# Altium project MotionBoard.PrjPcb (part 1 of 3)
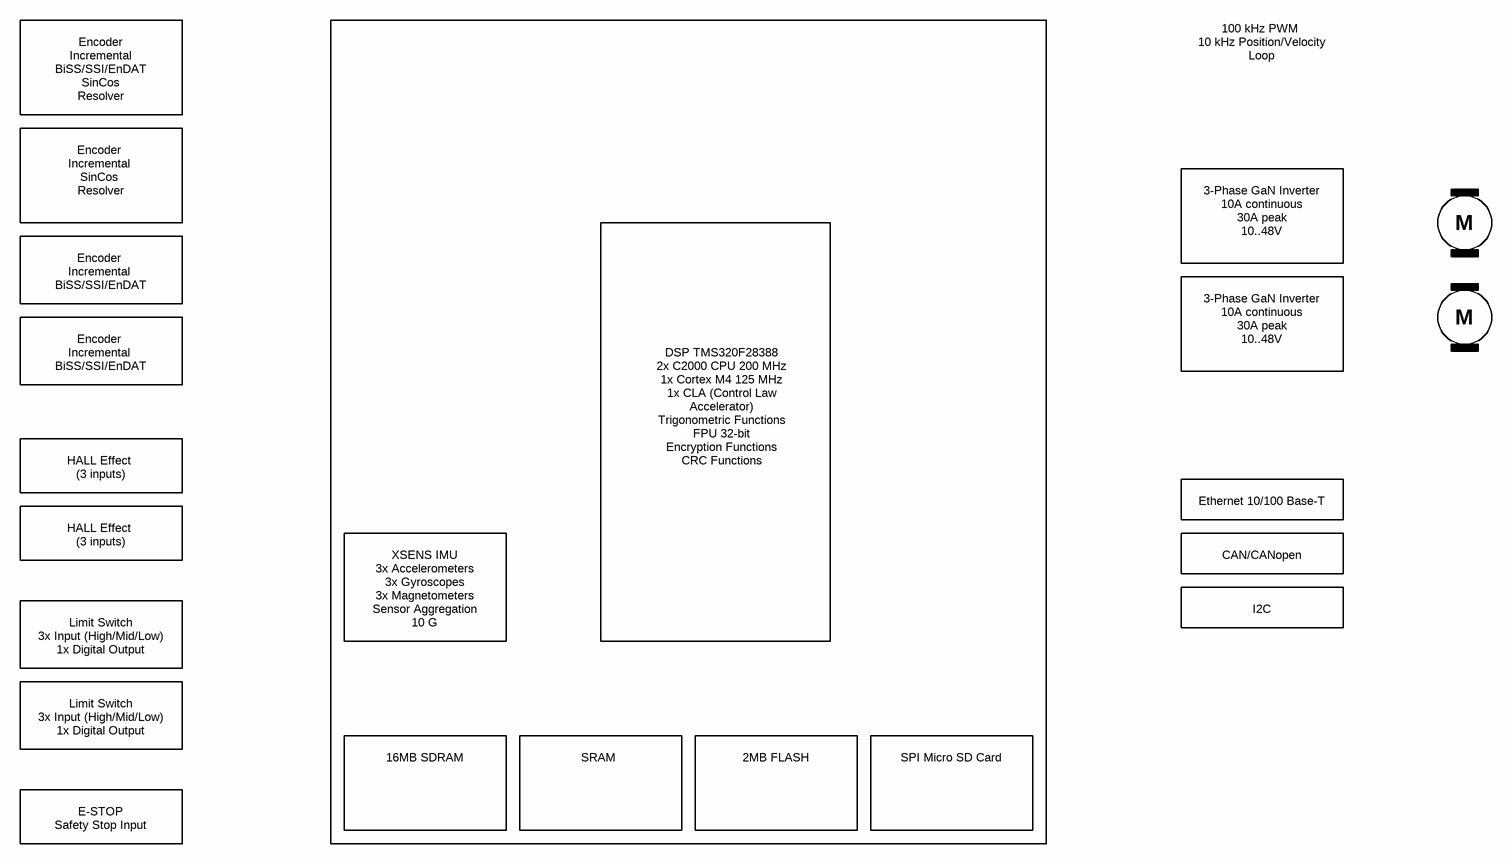
[diagram p0: overview.SchDoc]
Author: Prof. Yves Chevallier; NoProject: 377481; ProjectTitle: MotionBoard Columbi; SVN: GIT; Version: 0.1.0
17 sheets, 708 parts. Net scope: strictly hierarchical (ports join the sheet entries above them; power ports are local).
Board file: MotionBoard.PcbDoc
Sheets:
  overview.SchDoc
  main.SchDoc
    U_INVERTER-A = inverter.SchDoc
    U_ENC-A = digital-encoder.SchDoc
    CAN Transciever = can.SchDoc
    U_INVERTER-B = inverter.SchDoc
    DSP = dsp.SchDoc
      ADC/DAC = adc.SchDoc
      U_dsp-supply = dsp-supply.SchDoc
    Ethernet PHY = ethernet.SchDoc
    Designator = psu.SchDoc
    SDRAM/SRAM/FLASH = ext-memory.SchDoc
    USB HOST/DEVICE = usb.SchDoc
    Resolver Pseudo Sine Excitation = resolver-excitation.SchDoc
    U_ENC-C = analog-encoder.SchDoc
    Interial Management Unit = imu.SchDoc
    U_ENC-A = digital-encoder.SchDoc
    SDCARD = sdcard.SchDoc
    U_ENC-D = analog-encoder.SchDoc
    U_mechanical = mechanical.SchDoc

## Sheet overview.SchDoc: Overview
size A3; SheetNumber: 1; SheetTotal: 16

### Notes on the sheet
- Encoder
  Incremental
  BiSS/SSI/EnDAT
  SinCos
  Resolver
- 100 kHz PWM
  10 kHz Position/Velocity Loop
- Encoder
  Incremental
  SinCos
  Resolver
- 3-Phase GaN Inverter
  10A continuous
  30A peak
  10..48V
- M
- Encoder
  Incremental
  BiSS/SSI/EnDAT
- HALL Effect
  (3 inputs)
- DSP TMS320F28388
  2x C2000 CPU 200 MHz
  1x Cortex M4 125 MHz
  1x CLA (Control Law Accelerator)
  Trigonometric Functions
  FPU 32-bit
  Encryption Functions
  CRC Functions
- Ethernet 10/100 Base-T
- CAN/CANopen
- I2C
- Limit Switch
  3x Input (High/Mid/Low)
  1x Digital Output
- XSENS IMU
  3x Accelerometers
  3x Gyroscopes
  3x Magnetometers
  Sensor Aggregation
  10 G
- 16MB SDRAM
- SRAM
- 2MB FLASH
- SPI Micro SD Card
- E-STOP
  Safety Stop Input
- HES-SO / HEIG-VD / TIN / IAI
  Route de Cheseaux, 1
  CH-1401 Yverdon-les-Bains
  T +41 24 557 73 77    F +41 24 557 63 20
  http://iai.heig-vd.ch
  iai@heig-vd.ch
- Title
- Size
- Date
- A4
- Project
- Sheet
- of
- No.
- Author
- SVN/Git
- Version
- File

## Sheet main.SchDoc: Main Schema Block
size A3; SheetNumber: 2; SheetTotal: 17
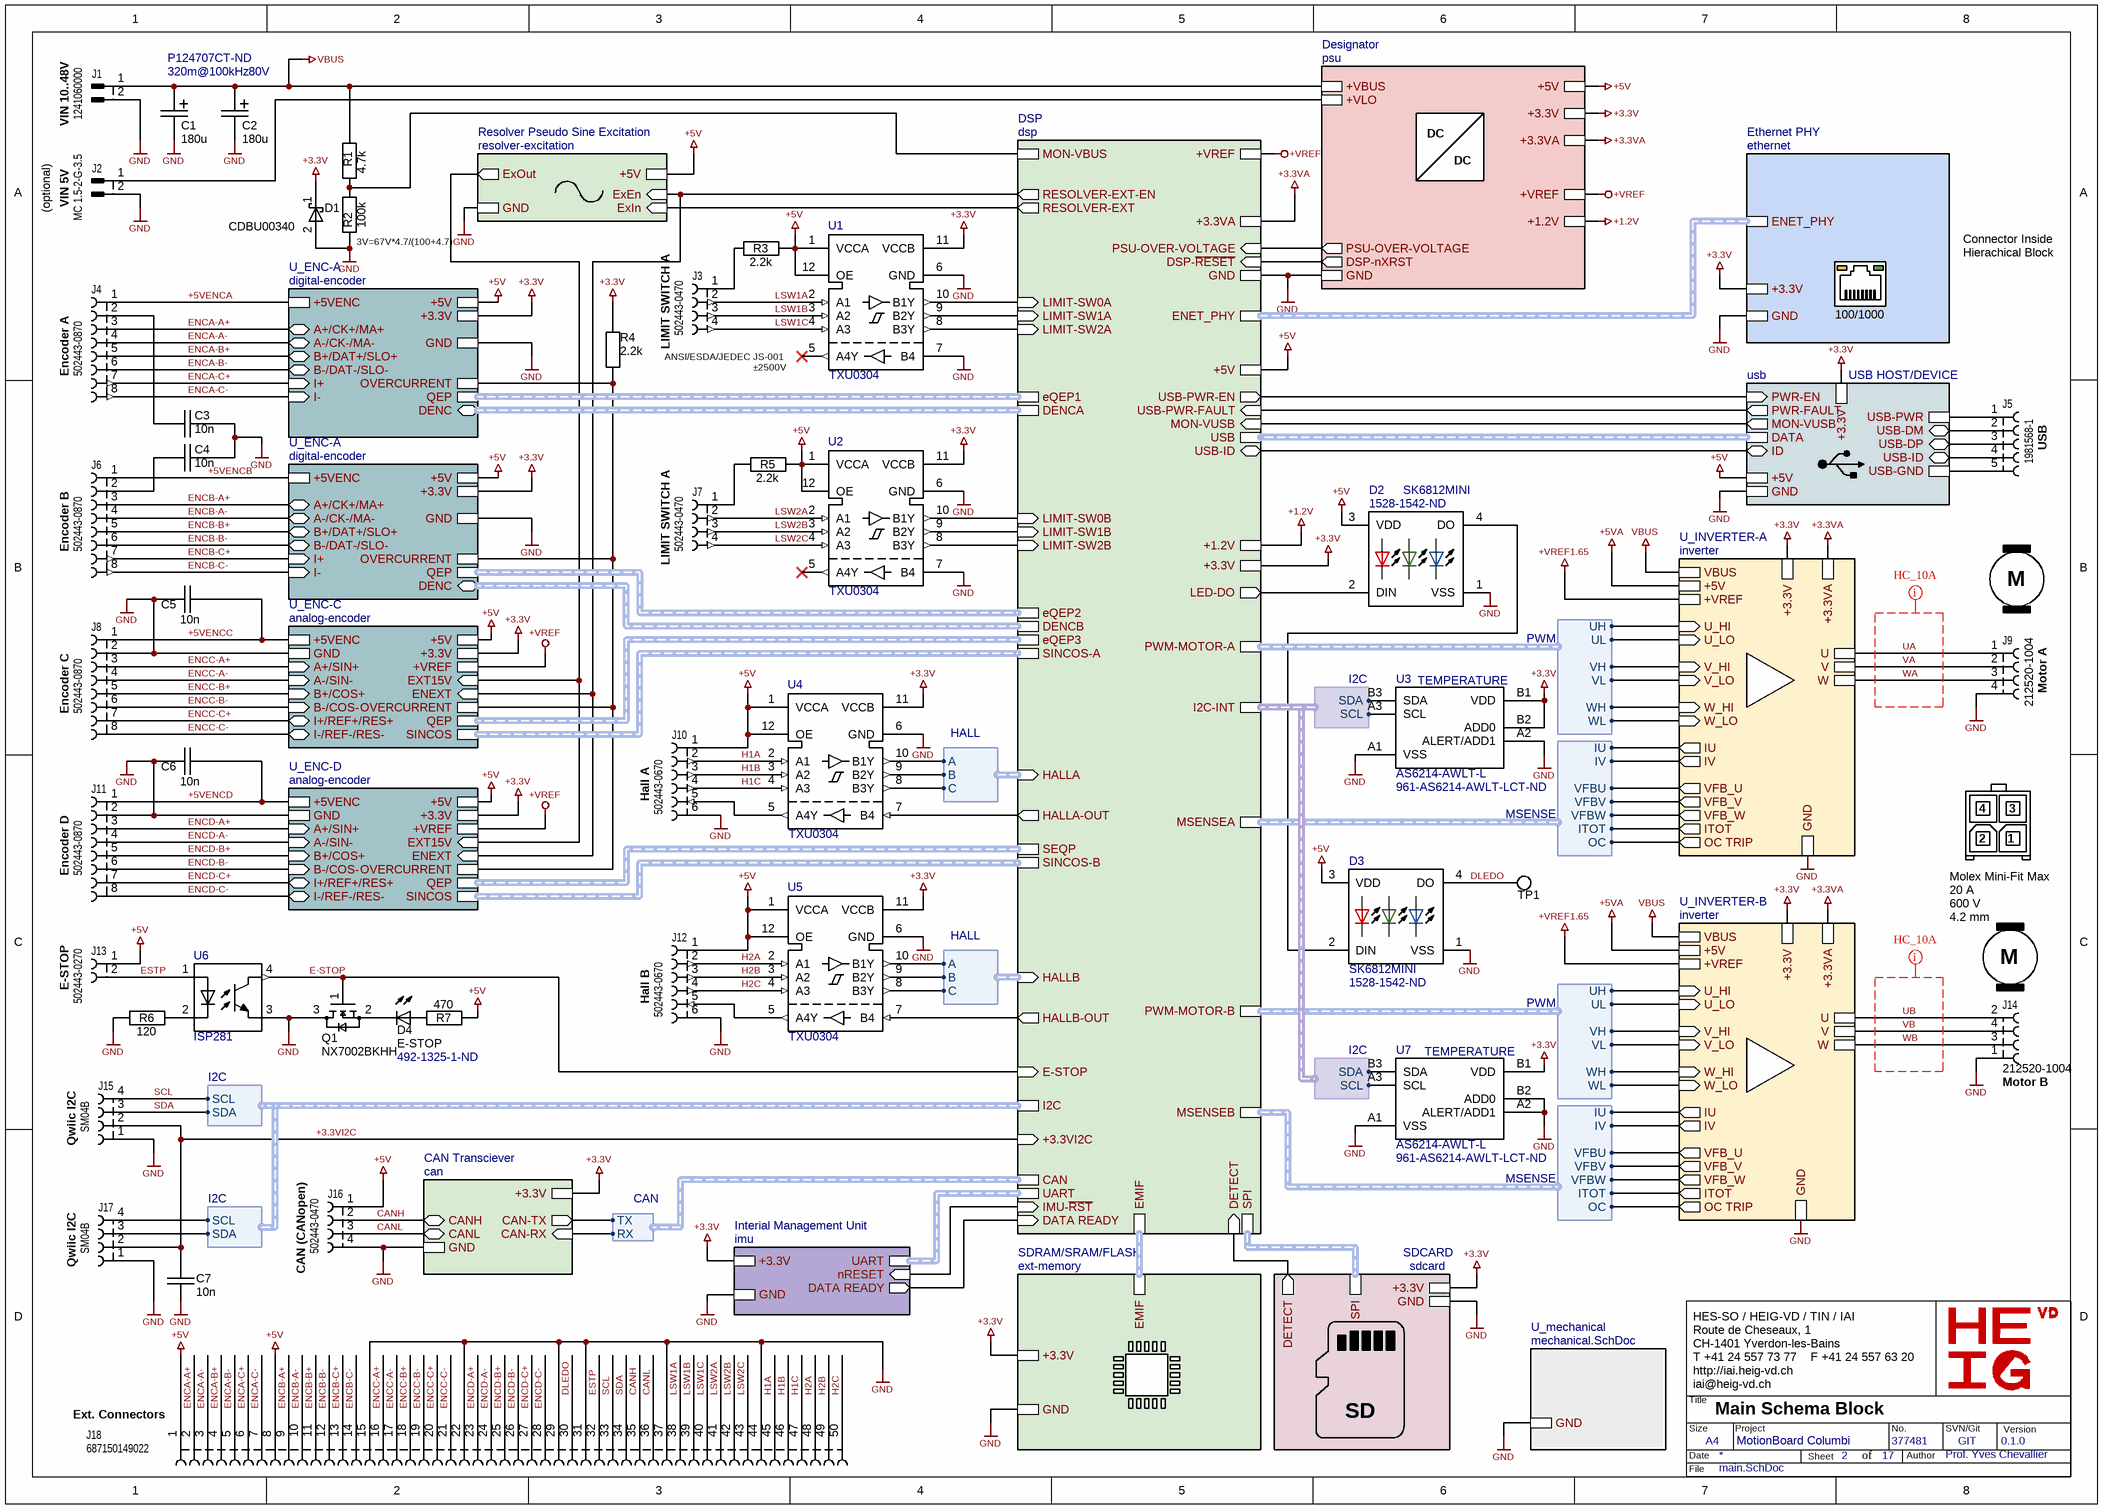
[diagram p1: main.SchDoc]

### Parts
(Parts that share a designator on the sheet are numbered #1, #2 ... from top to bottom, then left to right.)
C1  180u  Voltage: 80V  ESR: 320m@100kHz  Supplier Part Number 1: P124707CT-ND  [CAP_EEEFK1K151AV]
C2  180u  [CAP_EEEFK1K151AV]
C3  10n  [SM/C0402]
C4  10n  [SM/C0402]
C5  10n  [SM/C0402]
C6  10n  [SM/C0402]
C7  10n  [SM/C0402]
D1  CDBU00340  [SM/D0603/SOD523F]
D2  SK6812MINI  Supplier Part Number 1: 1528-1542-ND  [LED_SK6812]
D3  SK6812MINI  Supplier Part Number 1: 1528-1542-ND  [LED_SK6812]
D4  E-STOP  Supplier Part Number 1: 492-1325-1-ND  [SM/LED0603]
J1  1241060000  Function: VIN 10..48V  [CONN 2POS WEIDMULLER 5.08mm]
J2  MC 1.5-2-G-3.5  Function: VIN 5V  [CONN2/PHOENIX/MC 1.5-2-G-3.5]
J3  502443-0470  Function: LIMIT SWITCH A  [MOLEX/5024430470/CLIK-MATE/2mm]
J4  502443-0870  Function: Encoder A  [MOLEX/5024430870/CLIK-MATE/2mm]
J5#1  1981568-1  Function: USB  [TE/1981568-1/USB]
J6  502443-0870  Function: Encoder B  [MOLEX/5024430870/CLIK-MATE/2mm]
J7  502443-0470  Function: LIMIT SWITCH A  [MOLEX/5024430470/CLIK-MATE/2mm]
J8  502443-0870  Function: Encoder C  [MOLEX/5024430870/CLIK-MATE/2mm]
J9  212520-1004  Function: Motor A  [MOLEX/2125201004]
J10  502443-0670  Function: Hall A  [MOLEX/5024430670/CLIK-MATE/2mm]
J11  502443-0870  Function: Encoder D  [MOLEX/5024430870/CLIK-MATE/2mm]
J12  502443-0670  Function: Hall B  [MOLEX/5024430670/CLIK-MATE/2mm]
J13  502443-0270  Function: E-STOP  [MOLEX/5024430270/CLIK-MATE/2mm]
J14  212520-1004  Function: Motor B  [MOLEX/2125201004]
J15  SM04B  Function: Qwiic I2C  [QWIIC-SM04B-SRSS-TB]
J16  502443-0470  Function: CAN (CANopen)  [MOLEX/5024430470/CLIK-MATE/2mm]
J17  SM04B  Function: Qwiic I2C  [QWIIC-SM04B-SRSS-TB]
J18  687150149022  Function: Ext. Connectors  [687150149022]
Q1  NX7002BKHH  [SOT8001/DFN0606-3]
R1  4.7k  [SM/R0402]
R2  100k  [SM/R0805]
R3  2.2k  [SM/R0402]
R4  2.2k  [SM/R0402]
R5  2.2k  [SM/R0402]
R6  120  [SM/R0402]
R7  470  [SM/R0603]
TP1  RCUCTE  [TP/RCUCT]  (value not drawn)
U1  TXU0304  [QFN40P170X200X55-12N]
U2  TXU0304  [QFN40P170X200X55-12N]
U3  AS6214-AWLT-L  Supplier Part Number 1: 961-AS6214-AWLT-LCT-ND  [AS6214-AWLT-L_AMS]
U4  TXU0304  [QFN40P170X200X55-12N]
U5  TXU0304  [QFN40P170X200X55-12N]
U6  ISP281  [SOIC-4]
U7#1  AS6214-AWLT-L  Supplier Part Number 1: 961-AS6214-AWLT-LCT-ND  [AS6214-AWLT-L_AMS]

### Sub-sheets
CAN Transciever = can: CANL (bidir), CAN-RX (in), CANH (bidir), GND, CAN-TX (out), +3.3V
Designator = psu: DSP-nXRST (out), +3.3VA, +1.2V, +VBUS, +VLO, GND, +3.3V, +5V, +VREF, PSU-OVER-VOLTAGE (out)
DSP = dsp: SINCOS-B (harness SINCOS), MSENSEB (harness MSENSE), MSENSEA (harness MSENSE), SINCOS-A (harness SINCOS), I2C (harness I2C), EMIF (harness EMIF), PWM-MOTOR-A (harness PWM), CAN (harness CAN), ENET_PHY (harness ETHERNET), PWM-MOTOR-B (harness PWM), +3.3VI2C (in), USB-PWR-EN (out), USB-ID (bidir), USB-PWR-FAULT (in), USB (harness USB), HALLA (in, harness HALL), HALLB (in, harness HALL), LIMIT-SW0A (in), LIMIT-SW1A (in), LIMIT-SW2A (in), LIMIT-SW0B (in), LIMIT-SW1B (in), LIMIT-SW2B (in), eQEP3 (harness EQEP), SPI (harness SPI), eQEP2 (harness EQEP), E-STOP (in), eQEP1 (harness EQEP), DATA READY (in), +3.3V, +3.3VA, GND, +1.2V, +5V, HALLA-OUT (out), HALLB-OUT (out), I2C-INT (harness I2C), LED-DO (out), UART (harness UART), RESOLVER-EXT-EN (out), RESOLVER-EXT (out), IMU-~{RST} (in), DSP-~{RESET} (in), PSU-OVER-VOLTAGE (in), DENCA (harness DENC), SEQP (harness EQEP), DETECT (in), MON-VBUS, MON-VUSB (in), DENCB (harness DENC), +VREF
Ethernet PHY = ethernet: GND, ENET_PHY (harness ETHERNET), +3.3V
Interial Management Unit = imu: DATA READY (out), nRESET (in), UART (harness UART), GND, +3.3V
Resolver Pseudo Sine Excitation = resolver-excitation: ExEn (in), +5V, ExOut (out), GND, ExIn (in)
SDCARD = sdcard: +3.3V, SPI (harness SPI), GND, DETECT (out)
SDRAM/SRAM/FLASH = ext-memory: +3.3V, EMIF (harness EMIF), GND
U_ENC-A = digital-encoder: I+ (in), +5VENC, +3.3V, +5V, I- (in), B+/DAT+/SLO+ (bidir), A-/CK-/MA- (bidir), A+/CK+/MA+ (bidir), B-/DAT-/SLO- (bidir), DENC (bidir, harness DENC), QEP (harness EQEP), GND, OVERCURRENT
U_ENC-A = digital-encoder: I+ (in), +5VENC, +3.3V, +5V, I- (in), B+/DAT+/SLO+ (bidir), A-/CK-/MA- (bidir), A+/CK+/MA+ (bidir), B-/DAT-/SLO- (bidir), DENC (bidir, harness DENC), QEP (harness EQEP), GND, OVERCURRENT
U_ENC-C = analog-encoder: SINCOS (harness SINCOS), +5VENC, EXT15V (in), OVERCURRENT, +3.3V, +5V, I+/REF+/RES+ (bidir), I-/REF-/RES- (bidir), B-/COS- (in), B+/COS+ (in), A+/SIN+ (in), A-/SIN- (in), ENEXT (in), +VREF, GND, QEP (harness EQEP)
U_ENC-D = analog-encoder: SINCOS (harness SINCOS), +5VENC, EXT15V (in), OVERCURRENT, +3.3V, +5V, I+/REF+/RES+ (bidir), I-/REF-/RES- (bidir), B-/COS- (in), B+/COS+ (in), A+/SIN+ (in), A-/SIN- (in), ENEXT (in), +VREF, GND, QEP (harness EQEP)
U_INVERTER-A = inverter: U_LO (in), V_HI (in), U, VBUS, V, IU (out), W, V_LO (in), IV (out), U_HI (in), W_HI (in), W_LO (in), OC TRIP (out), VFB_W (out), ITOT (out), VFB_V (out), VFB_U (out), GND, +3.3V, +5V, +VREF, +3.3VA
U_INVERTER-B = inverter: U_LO (in), V_HI (in), U, VBUS, V, IU (out), W, V_LO (in), IV (out), U_HI (in), W_HI (in), W_LO (in), OC TRIP (out), VFB_W (out), ITOT (out), VFB_V (out), +VREF, VFB_U (out), +5V, GND, +3.3V, +3.3VA
U_mechanical = mechanical.SchDoc: GND
USB HOST/DEVICE = usb: GND, +5V, USB-DP (bidir), USB-DM (bidir), USB-PWR, USB-GND, USB-ID (bidir), PWR-EN (in), MON-VUSB (out), ID (bidir), DATA (harness USB), PWR-FAULT (out), +3.3V

### Harnesses
I2C: SCL, SDA
CAN: RX, TX
PWM: UH, UL, VH, VL, WH, WL
MSENSE: IU, IV, VFBU, VFBV, ITOT, OC, VFBW
HALL: A, B, C

### Nets
+1.2V: sheet DSP/+1.2V, sheet Designator/+1.2V
+3.3V: D1.1(K) R4.2 U1.11(VCCB) U2.11(VCCB) U3.B1(VDD) U3.B2(ADD0) U4.11(VCCB) U5.11(VCCB) U7#1.B1(VDD) ; sheet U_INVERTER-A/+3.3V, sheet U_ENC-A/+3.3V, sheet CAN Transciever/+3.3V, sheet U_INVERTER-B/+3.3V, sheet DSP/+3.3V, sheet Ethernet PHY/+3.3V, sheet Designator/+3.3V, sheet SDRAM/SRAM/FLASH/+3.3V, sheet USB HOST/DEVICE/+3.3V, sheet U_ENC-C/+3.3V, sheet Interial Management Unit/+3.3V, sheet U_ENC-A/+3.3V, sheet SDCARD/+3.3V, sheet U_ENC-D/+3.3V
+3.3VA: sheet U_INVERTER-A/+3.3VA, sheet U_INVERTER-B/+3.3VA, sheet DSP/+3.3VA, sheet Designator/+3.3VA
+5V: D2.3(VDD) D3.3(VDD) J10.1 J12.1 J13.1 J16.1 J18.1 J18.8 R3.2 R5.2 R7.2 U1.1(VCCA) U1.12(OE) U2.1(VCCA) U2.12(OE) U4.1(VCCA) U4.12(OE) U5.1(VCCA) U5.12(OE) ; sheet U_ENC-A/+5V, sheet DSP/+5V, sheet Designator/+5V, sheet USB HOST/DEVICE/+5V, sheet Resolver Pseudo Sine Excitation/+5V, sheet U_ENC-C/+5V, sheet U_ENC-A/+5V, sheet U_ENC-D/+5V
+5VA: sheet U_INVERTER-A/+5V, sheet U_INVERTER-B/+5V
+VREF: sheet DSP/+VREF, sheet Designator/+VREF, sheet U_ENC-C/+VREF, sheet U_ENC-D/+VREF
+VREF1.65: sheet U_INVERTER-A/+VREF, sheet U_INVERTER-B/+VREF
GND: C1.2(-) C2.2(-) C3.1 C4.1 C5.2 C6.2 C7.2 D1.2(A) D2.1(VSS) D3.1(VSS) J1.2 J2.2 J8.2 J9.4 J10.6 J11.2 J12.6 J14.1 J15.1 J16.4 J17.1 J18.15 J18.22 J18.29 J18.31 J18.37 J18.44 Q1.3(VCC) R2.2 R6.1 U1.6(GND) U1.7(B4) U2.6(GND) U2.7(B4) U3.A1(VSS) U3.A2(ALERT/ADD1) U4.6(GND) U5.6(GND) U6.3(E) U7#1.A1(VSS) U7#1.A2(ALERT/ADD1) U7#1.B2(ADD0) ; sheet U_INVERTER-A/GND, sheet U_ENC-A/GND, sheet CAN Transciever/GND, sheet U_INVERTER-B/GND, sheet DSP/GND, sheet Ethernet PHY/GND, sheet Designator/GND, sheet SDRAM/SRAM/FLASH/GND, sheet USB HOST/DEVICE/GND, sheet Resolver Pseudo Sine Excitation/GND, sheet U_ENC-C/GND, sheet Interial Management Unit/GND, sheet U_ENC-A/GND, sheet SDCARD/GND, sheet U_ENC-D/GND, sheet U_mechanical/GND
VBUS: C1.1(+) C2.1(+) J1.1 R1.1 ; sheet U_INVERTER-A/VBUS, sheet U_INVERTER-B/VBUS, sheet Designator/+VBUS
+3.3VI2C: C7.1 J15.2 J17.2 ; sheet DSP/+3.3VI2C
+5VENCA: J4.1 ; sheet U_ENC-A/+5VENC
+5VENCB: J6.1 ; sheet U_ENC-A/+5VENC
+5VENCC: C5.1 J8.1 ; sheet U_ENC-C/+5VENC
+5VENCD: C6.1 J11.1 ; sheet U_ENC-D/+5VENC
+VLO: J2.1 ; sheet Designator/+VLO
CAN-RX: sheet CAN Transciever/CAN-RX, sheet DSP/CAN.RX
CAN-TX: sheet CAN Transciever/CAN-TX, sheet DSP/CAN.TX
CANH: J16.2 J18.35 ; sheet CAN Transciever/CANH
CANL: J16.3 J18.36 ; sheet CAN Transciever/CANL
DATA READY: sheet DSP/DATA READY, sheet Interial Management Unit/DATA READY
DETECT: sheet DSP/DETECT, sheet SDCARD/DETECT
DLEDO: D3.4(DO) J18.30 TP1.1
DSP-~{XRST}: sheet DSP/DSP-~{RESET}, sheet Designator/DSP-nXRST
E-STOP: Q1.1(VCC) U6.4(C) ; sheet DSP/E-STOP
ENCA-A+: J4.3 J18.2 ; sheet U_ENC-A/A+/CK+/MA+
ENCA-A-: J4.4 J18.3 ; sheet U_ENC-A/A-/CK-/MA-
ENCA-B+: J4.5 J18.4 ; sheet U_ENC-A/B+/DAT+/SLO+
ENCA-B-: J4.6 J18.5 ; sheet U_ENC-A/B-/DAT-/SLO-
ENCA-C+: J4.7 J18.6 ; sheet U_ENC-A/I+
ENCA-C-: J4.8 J18.7 ; sheet U_ENC-A/I-
ENCB-A+: J6.3 J18.9 ; sheet U_ENC-A/A+/CK+/MA+
ENCB-A-: J6.4 J18.10 ; sheet U_ENC-A/A-/CK-/MA-
ENCB-B+: J6.5 J18.11 ; sheet U_ENC-A/B+/DAT+/SLO+
ENCB-B-: J6.6 J18.12 ; sheet U_ENC-A/B-/DAT-/SLO-
ENCB-C+: J6.7 J18.13 ; sheet U_ENC-A/I+
ENCB-C-: J6.8 J18.14 ; sheet U_ENC-A/I-
ENCC-A+: J8.3 J18.16 ; sheet U_ENC-C/A+/SIN+
ENCC-A-: J8.4 J18.17 ; sheet U_ENC-C/A-/SIN-
ENCC-B+: J8.5 J18.18 ; sheet U_ENC-C/B+/COS+
ENCC-B-: J8.6 J18.19 ; sheet U_ENC-C/B-/COS-
ENCC-C+: J8.7 J18.20 ; sheet U_ENC-C/I+/REF+/RES+
ENCC-C-: J8.8 J18.21 ; sheet U_ENC-C/I-/REF-/RES-
ENCD-A+: J11.3 J18.23 ; sheet U_ENC-D/A+/SIN+
ENCD-A-: J11.4 J18.24 ; sheet U_ENC-D/A-/SIN-
ENCD-B+: J11.5 J18.25 ; sheet U_ENC-D/B+/COS+
ENCD-B-: J11.6 J18.26 ; sheet U_ENC-D/B-/COS-
ENCD-C+: J11.7 J18.27 ; sheet U_ENC-D/I+/REF+/RES+
ENCD-C-: J11.8 J18.28 ; sheet U_ENC-D/I-/REF-/RES-
ESTP: J13.2 J18.32 U6.1(A)
ExEn: sheet DSP/RESOLVER-EXT-EN, sheet Resolver Pseudo Sine Excitation/ExEn, sheet U_ENC-C/ENEXT, sheet U_ENC-D/ENEXT
ExIn: sheet DSP/RESOLVER-EXT, sheet Resolver Pseudo Sine Excitation/ExIn
ExOut: sheet Resolver Pseudo Sine Excitation/ExOut, sheet U_ENC-C/EXT15V, sheet U_ENC-D/EXT15V
H1A: J10.2 J18.45 U4.2(A1)
H1B: J10.3 J18.46 U4.3(A2)
H1C: J10.4 J18.47 U4.4(A3)
H2A: J12.2 J18.48 U5.2(A1)
H2B: J12.3 J18.49 U5.3(A2)
H2C: J12.4 J18.50 U5.4(A3)
HALLA-OUT: U4.7(B4) ; sheet DSP/HALLA-OUT
HALLB-OUT: U5.7(B4) ; sheet DSP/HALLB-OUT
ID: sheet DSP/USB-ID, sheet USB HOST/DEVICE/ID
IMU-~{RST}: sheet DSP/IMU-~{RST}, sheet Interial Management Unit/nRESET
IU_U_INVERTER-A: sheet U_INVERTER-A/IU, sheet DSP/MSENSEA.IU
IU_U_INVERTER-B: sheet U_INVERTER-B/IU, sheet DSP/MSENSEB.IU
LIMIT-SW0A: U1.10(B1Y) ; sheet DSP/LIMIT-SW0A
LIMIT-SW0B: U2.10(B1Y) ; sheet DSP/LIMIT-SW0B
LIMIT-SW1A: U1.9(B2Y) ; sheet DSP/LIMIT-SW1A
LIMIT-SW1B: U2.9(B2Y) ; sheet DSP/LIMIT-SW1B
LIMIT-SW2A: U1.8(B3Y) ; sheet DSP/LIMIT-SW2A
LIMIT-SW2B: U2.8(B3Y) ; sheet DSP/LIMIT-SW2B
LSW1A: J3.2 J18.38 U1.2(A1)
LSW1B: J3.3 J18.39 U1.3(A2)
LSW1C: J3.4 J18.40 U1.4(A3)
LSW2A: J7.2 J18.41 U2.2(A1)
LSW2B: J7.3 J18.42 U2.3(A2)
LSW2C: J7.4 J18.43 U2.4(A3)
MON-VBUS: R1.2 R2.1 ; sheet DSP/MON-VBUS
MON-VUSB: sheet DSP/MON-VUSB, sheet USB HOST/DEVICE/MON-VUSB
PSU-OVER-VOLTAGE: sheet DSP/PSU-OVER-VOLTAGE, sheet Designator/PSU-OVER-VOLTAGE
PWR-EN: sheet DSP/USB-PWR-EN, sheet USB HOST/DEVICE/PWR-EN
PWR-FAULT: sheet DSP/USB-PWR-FAULT, sheet USB HOST/DEVICE/PWR-FAULT
SCL: J15.4 J17.4 J18.33 ; sheet DSP/I2C.SCL
SDA: J15.3 J17.3 J18.34 ; sheet DSP/I2C.SDA
UA: J9.1 ; sheet U_INVERTER-A/U
UB: J14.2 ; sheet U_INVERTER-B/U
VA: J9.2 ; sheet U_INVERTER-A/V
VB: J14.4 ; sheet U_INVERTER-B/V
WA: J9.3 ; sheet U_INVERTER-A/W
WB: J14.3 ; sheet U_INVERTER-B/W
NetC3_2: C3.2 J4.2
NetC4_2: C4.2 J6.2
NetD2_2: D2.2(DIN) ; sheet DSP/LED-DO
NetD2_4: D2.4(DO) D3.2(DIN)
NetD4_1: D4.1 R7.1
NetD4_2: D4.2 Q1.2(VCC)
NetJ3_1: J3.1 R3.1
NetJ5#1_1: J5#1.1 ; sheet USB HOST/DEVICE/USB-PWR
NetJ5#1_2: J5#1.2 ; sheet USB HOST/DEVICE/USB-DM
NetJ5#1_3: J5#1.3 ; sheet USB HOST/DEVICE/USB-DP
NetJ5#1_4: J5#1.4 ; sheet USB HOST/DEVICE/USB-ID
NetJ5#1_5: J5#1.5 ; sheet USB HOST/DEVICE/USB-GND
NetJ7_1: J7.1 R5.1
NetJ10_5: J10.5 U4.5(A4Y)
NetJ12_5: J12.5 U5.5(A4Y)
NetR4_1: R4.1 ; sheet U_ENC-A/OVERCURRENT, sheet U_ENC-C/OVERCURRENT, sheet U_ENC-A/OVERCURRENT, sheet U_ENC-D/OVERCURRENT
NetR6_2: R6.2 U6.2(K)
NetU3_A3: U3.A3(SCL) U7#1.A3(SCL) ; sheet DSP/I2C-INT.SCL
NetU3_B3: U3.B3(SDA) U7#1.B3(SDA) ; sheet DSP/I2C-INT.SDA
NetU4_8: U4.8(B3Y) ; sheet DSP/HALLA.C
NetU4_9: U4.9(B2Y) ; sheet DSP/HALLA.B
NetU4_10: U4.10(B1Y) ; sheet DSP/HALLA.A
NetU5_8: U5.8(B3Y) ; sheet DSP/HALLB.C
NetU5_9: U5.9(B2Y) ; sheet DSP/HALLB.B
NetU5_10: U5.10(B1Y) ; sheet DSP/HALLB.A
(unnamed): sheet U_INVERTER-A/U_LO, sheet DSP/PWM-MOTOR-A.UL
(unnamed): sheet U_INVERTER-A/V_HI, sheet DSP/PWM-MOTOR-A.VH
(unnamed): sheet U_INVERTER-A/V_LO, sheet DSP/PWM-MOTOR-A.VL
(unnamed): sheet U_INVERTER-A/IV, sheet DSP/MSENSEA.IV
(unnamed): sheet U_INVERTER-A/U_HI, sheet DSP/PWM-MOTOR-A.UH
(unnamed): sheet U_INVERTER-A/W_HI, sheet DSP/PWM-MOTOR-A.WH
(unnamed): sheet U_INVERTER-A/W_LO, sheet DSP/PWM-MOTOR-A.WL
(unnamed): sheet U_INVERTER-A/OC TRIP, sheet DSP/MSENSEA.OC
(unnamed): sheet U_INVERTER-A/VFB_W, sheet DSP/MSENSEA.VFBW
(unnamed): sheet U_INVERTER-A/ITOT, sheet DSP/MSENSEA.ITOT
(unnamed): sheet U_INVERTER-A/VFB_V, sheet DSP/MSENSEA.VFBV
(unnamed): sheet U_INVERTER-A/VFB_U, sheet DSP/MSENSEA.VFBU
(unnamed): sheet U_INVERTER-B/U_LO, sheet DSP/PWM-MOTOR-B.UL
(unnamed): sheet U_INVERTER-B/V_HI, sheet DSP/PWM-MOTOR-B.VH
(unnamed): sheet U_INVERTER-B/V_LO, sheet DSP/PWM-MOTOR-B.VL
(unnamed): sheet U_INVERTER-B/IV, sheet DSP/MSENSEB.IV
(unnamed): sheet U_INVERTER-B/U_HI, sheet DSP/PWM-MOTOR-B.UH
(unnamed): sheet U_INVERTER-B/W_HI, sheet DSP/PWM-MOTOR-B.WH
(unnamed): sheet U_INVERTER-B/W_LO, sheet DSP/PWM-MOTOR-B.WL
(unnamed): sheet U_INVERTER-B/OC TRIP, sheet DSP/MSENSEB.OC
(unnamed): sheet U_INVERTER-B/VFB_W, sheet DSP/MSENSEB.VFBW
(unnamed): sheet U_INVERTER-B/ITOT, sheet DSP/MSENSEB.ITOT
(unnamed): sheet U_INVERTER-B/VFB_V, sheet DSP/MSENSEB.VFBV
(unnamed): sheet U_INVERTER-B/VFB_U, sheet DSP/MSENSEB.VFBU

Not connected (* = marked no-connect by the designer): U1 5(A4Y)*; U2 5(A4Y)*

### Buses and harness runs
harness sheet DSP/DENCA = sheet U_ENC-A/DENC
harness sheet DSP/DENCB = sheet U_ENC-A/DENC
harness sheet DSP/EMIF = sheet SDRAM/SRAM/FLASH/EMIF
harness sheet DSP/ENET_PHY = sheet Ethernet PHY/ENET_PHY
harness sheet DSP/eQEP1 = sheet U_ENC-A/QEP
harness sheet DSP/eQEP2 = sheet U_ENC-A/QEP
harness sheet DSP/eQEP3 = sheet U_ENC-C/QEP
harness sheet DSP/SEQP = sheet U_ENC-D/QEP
harness sheet DSP/SINCOS-A = sheet U_ENC-C/SINCOS
harness sheet DSP/SINCOS-B = sheet U_ENC-D/SINCOS
harness sheet DSP/SPI = sheet SDCARD/SPI
harness sheet DSP/UART = sheet Interial Management Unit/UART
harness sheet DSP/USB = sheet USB HOST/DEVICE/DATA

### Layout directives
net class HC_10A: UA, UB, VA, VB, WA, WB

### Notes on the sheet
- (optional)
- DC
- (near R2) 3V=67V*4.7/(100+4.7)
- 100/1000
- Connector Inside
  Hierachical Block
- ANSI/ESDA/JEDEC JS-001
  ±2500V
- M
- (near U3) TEMPERATURE
- 2
- 4
- 1
- 3
- Molex Mini-Fit Max
  20 A
  600 V
  4.2 mm
- (near J14) M
- (near U7#1) TEMPERATURE
- SD
- HES-SO / HEIG-VD / TIN / IAI
  Route de Cheseaux, 1
  CH-1401 Yverdon-les-Bains
  T +41 24 557 73 77    F +41 24 557 63 20
  http://iai.heig-vd.ch
  iai@heig-vd.ch
- Title
- Size
- Date
- A4
- Project
- Sheet
- of
- No.
- Author
- SVN/Git
- Version
- File

### Library data of the parts
C1 = C+: Capacitor; Supplier 1: Digi-Key
C2 = C+: Capacitor; Voltage: 80V; ESR: 320m@100kHz; Supplier 1: Digi-Key; Supplier Part Number 1: P124707CT-ND
C3-C7 = C: C0402C103K8RAC7867; Dielectric: X7R; Voltage: 10V; Supplier 1: Digi-Key; Supplier Part Number 1: 399-C0402C103K8RAC7867CT-ND; Value: 10n
D1 = D SCHOTTKY: Supplier 1: Digi-Key; Supplier Part Number 1: S1AB-FDICT-ND
D2 D3 = SK6812MINI: Addressable Lighting series 10 LED Discrete Serial (Shift Register) Red, Green, Blue (RGB) 3.50mm L x 3.50mm W; Supplier 1: Digi-Key
D4 = LED: Supplier 1: Digi-Key
J1 J2 = CONN 2 Plug
  J1: Supplier 1: Digi-Key; Supplier Part Number 1: 281-4411-ND
J3 J7 = MOLEX/CONN 4 Clik-Mate 2mm Vertical: CLIK-Mate Vertical Receptacle, PCB Receptacle, Surface Mount, 1 Rows, 4 Contacts, 2mm Pitch, Molex; Supplier 1: Distrelec; Supplier Part Number 1: 30161193
J4 J6 J8 J11 = MOLEX/CONN 8 Clik-Mate Vertical 2mm: CLIK-Mate Vertical Receptacle, PCB Receptacle, Surface Mount, 1 Rows, 8 Contacts, 2mm Pitch, Molex; Supplier 1: Distrelec; Supplier Part Number 1: 30161195
J5#1 = CONN 5 Socket: USB - micro B USB 2.0 Receptacle Connector 5 Position Surface Mount, Right Angle; Supplier 1: Digi-Key; Supplier Part Number 1: A97800CT-ND
J9 J14 = CONN 4 Socket
J10 J12 = MOLEX/CONN 6 Clik-Mate Vertical 2mm: CLIK-Mate Vertical Receptacle, PCB Receptacle, Surface Mount, 1 Rows, 6 Contacts, 2mm Pitch, Molex; Supplier 1: Distrelec; Supplier Part Number 1: 30161194
J13 = CONN 2 Socket: Supplier 1: Digi-Key; Supplier Part Number 1: WM15808CT-ND
J15 J17 = JST/CONN 4 Socket (Qwiic): JST Qwiic Connector; Supplier 1: Digi-Key; Supplier Part Number 1: 455-2645-6-ND
J16 = MOLEX/CONN 4 Clik-Mate Vertical 2mm: CLIK-Mate Vertical Receptacle, PCB Receptacle, Surface Mount, 1 Rows, 4 Contacts, 2mm Pitch, Molex; Supplier 1: Distrelec; Supplier Part Number 1: 30161193
J18 = CONN 50 Socket
Q1 = 2N7002: N-Channel 60 V 350mA (Ta) 380mW (Ta), 2.8W (Tc) Surface Mount DFN0606-3; Value: 2N7002; Supplier 1: Digi-Key; Supplier Part Number 1: 1727-8574-1-ND
R1 = R: 4.7 kOhms ±5% 0.063W, 1/16W Chip Resistor 0402 (1005 Metric) Moisture Resistant Thick Film; Supplier 1: Digi-Key; Supplier Part Number 1: 311-4.7KJRCT-ND; Value: 4.7k
R2 R6 = R: Chip Resistor SMD; Supplier 1: Digi-Key
  R2: Supplier Part Number 1: 311-100KLRCT-ND; Value: 100k
  R6: Value: 120; Supplier Part Number 1: 311-120LRCT-ND
R3-R5 = R: RC0402FR-072K2L; Value: 120; Supplier 1: Digi-Key; Supplier Part Number 1: 311-2.20KLRCT-ND
R7 = R: Chip Resistor SMD; Value: 1k
TP1 = TP: PC Test Point Plating Surface Mount Mounting Type; Supplier 1: Digi-Key; Supplier Part Number 1: 2019-RCUCTECT-ND
U1 U2 U4 U5 = TXU0304: FOUR CHANNEL UNIDIRECTIONAL LEVE / Voltage Level Translator Unidirectional 1 Circuit 4 Channel 200Mbps 12-UQFN (1.7x2); MP: TXB0104RGYR; Package: None; Price: None; Value: *; Availability: Unavailable; Supplier 1: Digi-Key; Supplier Part Number 1: 296-TXU0304RUTRCT-ND
U3 U7#1 = AS621x: Temperature Sensor Digital, Local -40°C ~ 125°C 16 b 6-WLCSP (1.5x1); Supplier 1: Digi-Key
U6 = ISP281: OPTOISOLATR 5KV TRANSISTOR 4-SMD; Value: ISP281; Supplier 1: Digi-Key; Supplier Part Number 1: 58-ISP281DCT-ND

## Sheet inverter.SchDoc: 3-Phase MOSFET Driver
size A3; SheetNumber: 7; SheetTotal: 18
Used 2 times, as channels U_INVERTER-A, U_INVERTER-B. Parts and nets are listed once, with the designators drawn on the sheet.
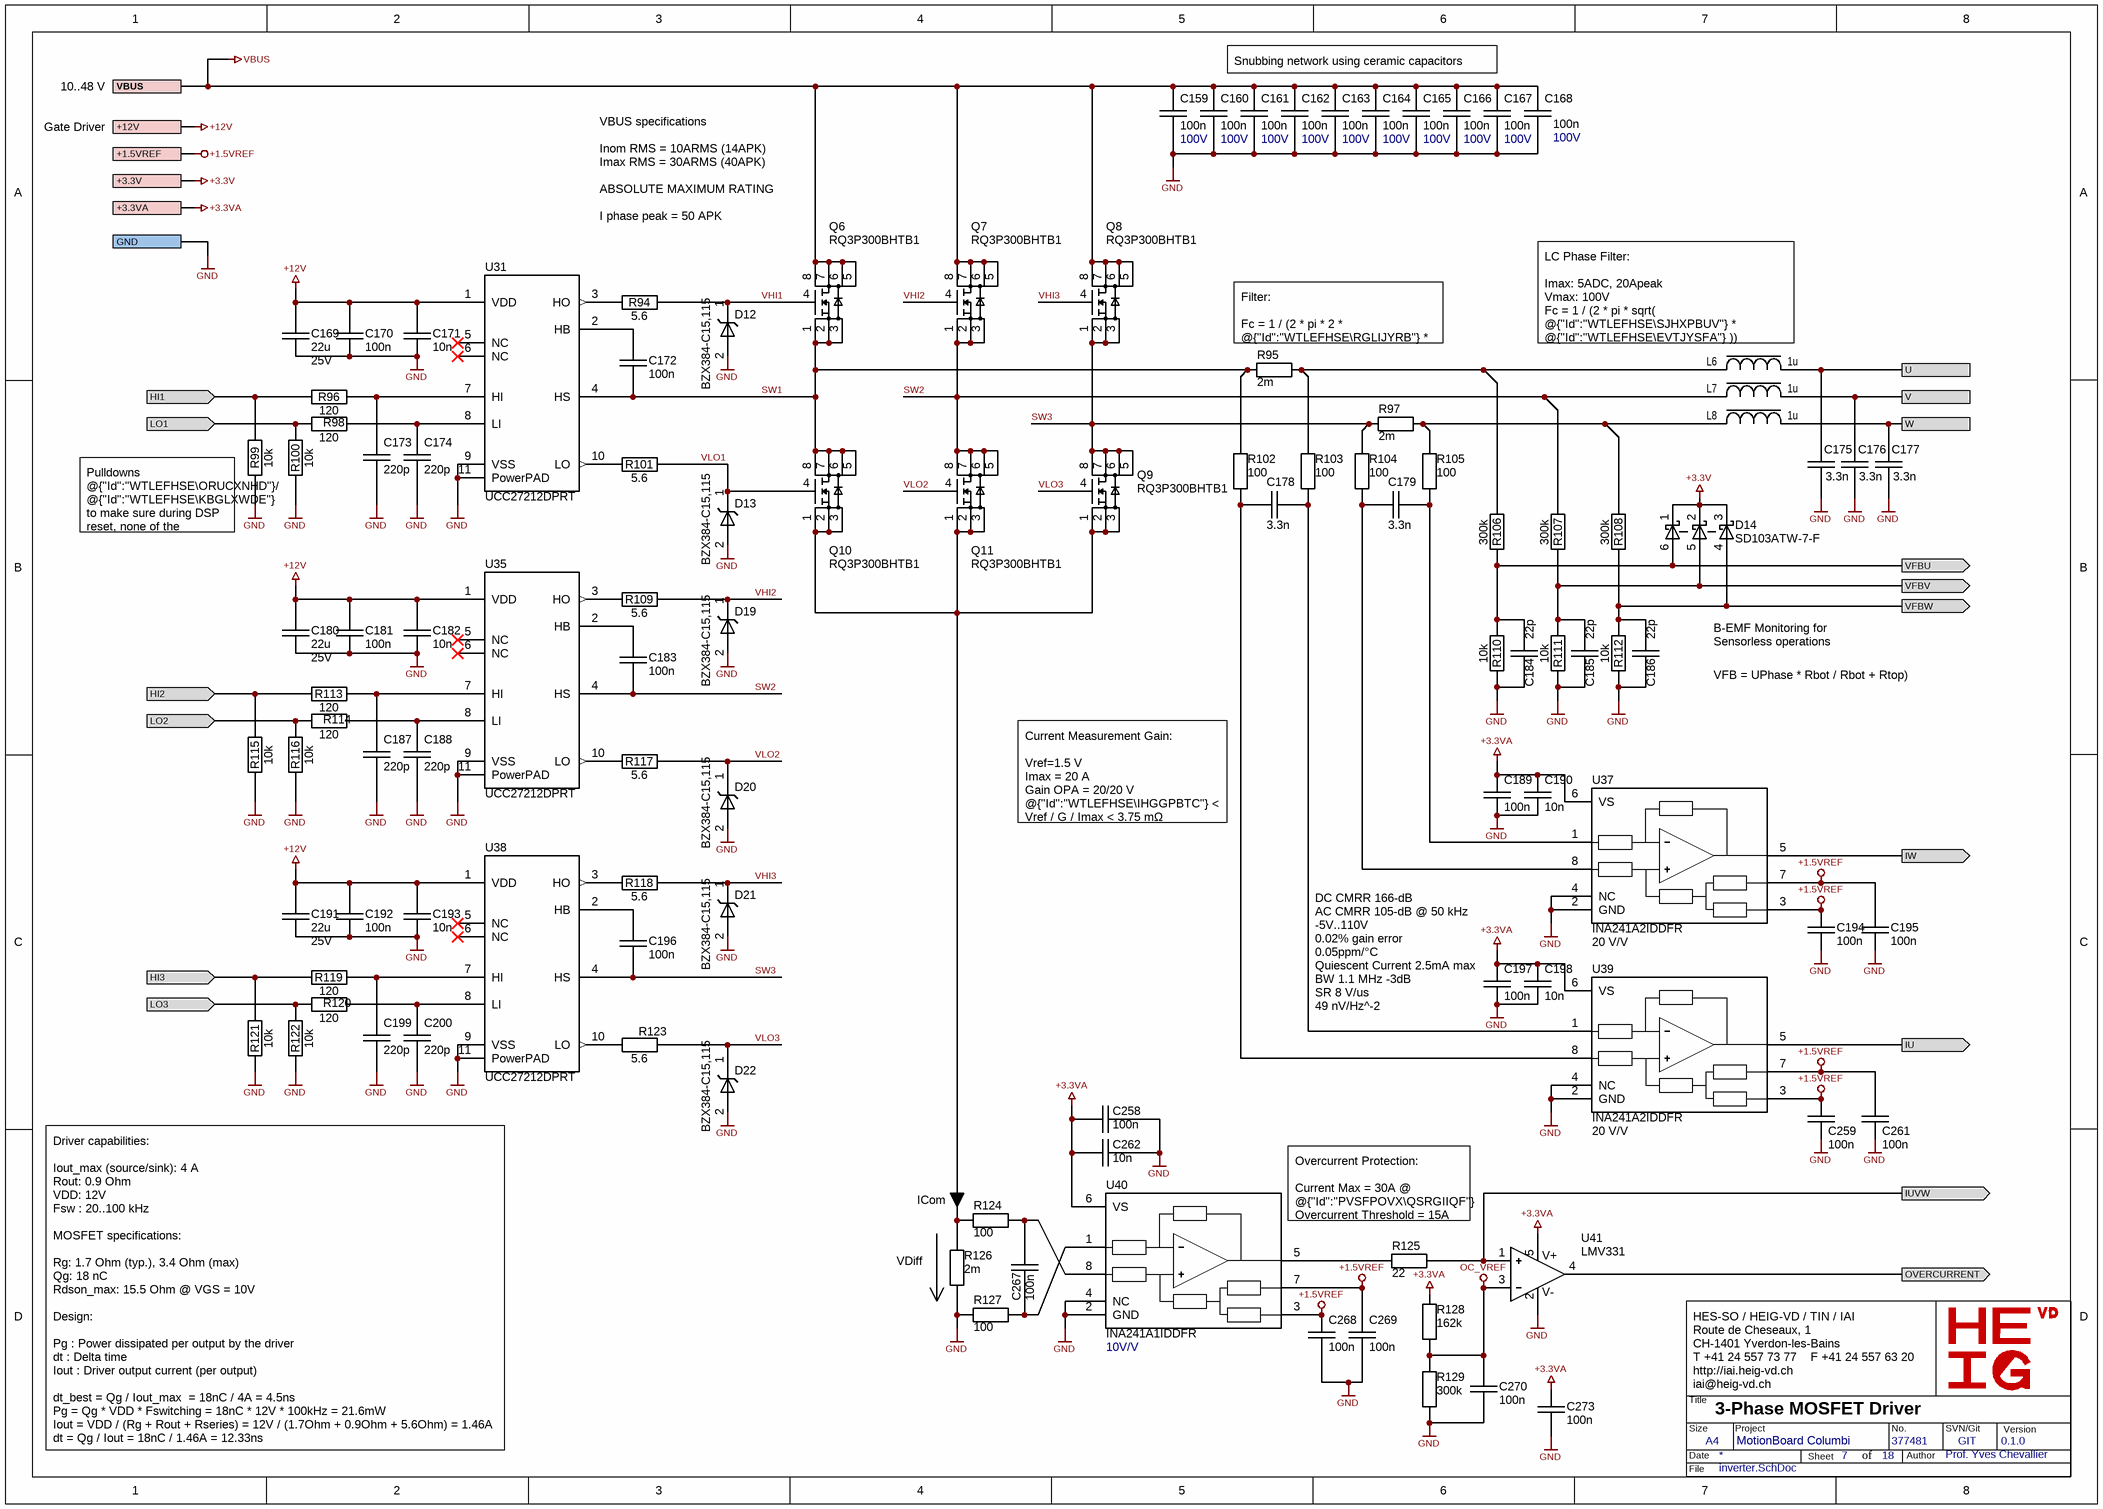
[diagram p2: inverter.SchDoc]

### Parts
C159  100n  Voltage: 100V  [SM/C1206]
C160  100n  Voltage: 100V  [SM/C1206]
C161  100n  Voltage: 100V  [SM/C1206]
C162  100n  Voltage: 100V  [SM/C1206]
C163  100n  Voltage: 100V  [SM/C1206]
C164  100n  Voltage: 100V  [SM/C1206]
C165  100n  Voltage: 100V  [SM/C1206]
C166  100n  Voltage: 100V  [SM/C1206]
C167  100n  Voltage: 100V  [SM/C1206]
C168  100n  Voltage: 100V  [SM/C1206]
C169  22u  Voltage: 25V  [SM/C0805]
C170  100n  [SM/C0402]
C171  10n  [SM/C0402]
C172  100n  [SM/C0402]
C173  220p  [SM/C0402]
C174  220p  [SM/C0402]
C175  3.3n  [SM/C0402]
C176  3.3n  [SM/C0402]
C177  3.3n  [SM/C0402]
C178  3.3n  [SM/C0402]
C179  3.3n  [SM/C0402]
C180  22u  Voltage: 25V  [SM/C0805]
C181  100n  [SM/C0402]
C182  10n  [SM/C0402]
C183  100n  [SM/C0402]
C184  22p  [SM/C0402]
C185  22p  [SM/C0402]
C186  22p  [SM/C0402]
C187  220p  [SM/C0402]
C188  220p  [SM/C0402]
C189  100n  [SM/C0402]
C190  10n  [SM/C0402]
C191  22u  Voltage: 25V  [SM/C0805]
C192  100n  [SM/C0402]
C193  10n  [SM/C0402]
C194  100n  [SM/C0402]
C195  100n  [SM/C0402]
C196  100n  [SM/C0402]
C197  100n  [SM/C0402]
C198  10n  [SM/C0402]
C199  220p  [SM/C0402]
C200  220p  [SM/C0402]
C258  100n  [SM/C0402]
C259  100n  [SM/C0402]
C261  100n  [SM/C0402]
C262  10n  [SM/C0402]
C267  100n  [SM/C0402]
C268  100n  [SM/C0402]
C269  100n  [SM/C0402]
C270  100n  [SM/C0402]
C273  100n  [SM/C0402]
D12  BZX384-C15,115  [SODFL250X110-2N]
D13  BZX384-C15,115  [SODFL250X110-2N]
D14  SD103ATW-7-F  [SC70-6]
D19  BZX384-C15,115  [SODFL250X110-2N]
D20  BZX384-C15,115  [SODFL250X110-2N]
D21  BZX384-C15,115  [SODFL250X110-2N]
D22  BZX384-C15,115  [SODFL250X110-2N]
L6  1u  [PA5005.102NLT]
L7  1u  [PA5005.102NLT]
L8  1u  [PA5005.102NLT]
Q6  RQ3P300BHTB1  [RQ3P300BHTB1]
Q7  RQ3P300BHTB1  [RQ3P300BHTB1]
Q8  RQ3P300BHTB1  [RQ3P300BHTB1]
Q9  RQ3P300BHTB1  [RQ3P300BHTB1]
Q10  RQ3P300BHTB1  [RQ3P300BHTB1]
Q11  RQ3P300BHTB1  [RQ3P300BHTB1]
R94  5.6  [SM/R0402]
R95  2m  [SM/R1206]
R96  120  [SM/R0402]
R97  2m  [SM/R1206]
R98  120  [SM/R0402]
R99  10k  [SM/R0402]
R100  10k  [SM/R0402]
R101  5.6  [SM/R0402]
R102  100  [SM/R0402]
R103  100  [SM/R0402]
R104  100  [SM/R0402]
R105  100  [SM/R0402]
R106  300k  [SM/R0402]
R107  300k  [SM/R0402]
R108  300k  [SM/R0402]
R109  5.6  [SM/R0402]
R110  10k  [SM/R0402]
R111  10k  [SM/R0402]
R112  10k  [SM/R0402]
R113  120  [SM/R0402]
R114  120  [SM/R0402]
R115  10k  [SM/R0402]
R116  10k  [SM/R0402]
R117  5.6  [SM/R0402]
R118  5.6  [SM/R0402]
R119  120  [SM/R0402]
R120  120  [SM/R0402]
R121  10k  [SM/R0402]
R122  10k  [SM/R0402]
R123  5.6  [SM/R0402]
R124  100  [SM/R0402]
R125  22  [SM/R0402]
R126  2m  [SM/R1206]
R127  100  [SM/R0402]
R128  162k  [SM/R0402]
R129  300k  [SM/R0402]
U31  UCC27212DPRT  [PSON80P400X80_HS-11N]
U35  UCC27212DPRT  [PSON80P400X80_HS-11N]
U37  INA241A2IDDFR  Gain: 20 V/V  [SOT65P280X110-8N]
U38  UCC27212DPRT  [PSON80P400X80_HS-11N]
U39  INA241A2IDDFR  Gain: 20 V/V  [SOT65P280X110-8N]
U40  INA241A1IDDFR  Gain: 10V/V  [SOT65P280X110-8N]
U41  LMV331  [SOT23-5]

### Ports
+1.5VREF, +3.3V, +3.3VA, +12V, GND, HI1 (in), HI2 (in), HI3 (in), IU (out), IUVW (out), IW (out), LO1 (in), LO2 (in), LO3 (in), OVERCURRENT (out), U, V, VBUS, VFBU (out), VFBV (out), VFBW (out), W

### Nets
+1.5VREF: C194.2 C195.2 C259.2 C261.2 C268.2 C269.2 U37.3(REF2) U37.7(REF1) U39.3(REF2) U39.7(REF1) U40.3(REF2) U40.7(REF1) ; port +1.5VREF
+3.3V: D14.1(K) D14.2(K) D14.3(K) ; port +3.3V
+3.3VA: C189.2 C190.1 C197.2 C198.1 C258.2 C262.1 C273.2 R128.2 U37.6(VS) U39.6(VS) U40.6(VS) U41.5(V+) ; port +3.3VA
+12V: C169.2 C170.2 C171.1 C180.2 C181.2 C182.1 C191.2 C192.2 C193.1 U31.1(VDD) U35.1(VDD) U38.1(VDD) ; port +12V
GND: C159.1 C160.1 C161.1 C162.1 C163.1 C164.1 C165.1 C166.1 C167.1 C168.1 C169.1 C170.1 C171.2 C173.1 C174.1 C175.1 C176.1 C177.1 C180.1 C181.1 C182.2 C184.1 C185.1 C186.1 C187.1 C188.1 C189.1 C190.2 C191.1 C192.1 C193.2 C194.1 C195.1 C197.1 C198.2 C199.1 C200.1 C258.1 C259.1 C261.1 C262.2 C268.1 C269.1 C270.1 C273.1 D12.2(A) D13.2(A) D19.2(A) D20.2(A) D21.2(A) D22.2(A) R99.2 R100.2 R110.1 R111.1 R112.1 R115.2 R116.2 R121.2 R122.2 R126.1 R127.2 R129.1 U31.9(VSS) U31.11(PowerPAD) U35.9(VSS) U35.11(PowerPAD) U37.2(GND) U37.4(NC) U38.9(VSS) U38.11(PowerPAD) U39.2(GND) U39.4(NC) U40.2(GND) U40.4(NC) U41.2(V-) ; port GND
OC_VREF: C270.2 R128.1 R129.2 U41.3(IN-)
VBUS: C159.2 C160.2 C161.2 C162.2 C163.2 C164.2 C165.2 C166.2 C167.2 C168.2 Q6.5(D) Q6.6(D) Q6.7(D) Q6.8(D) Q7.5(D) Q7.6(D) Q7.7(D) Q7.8(D) Q8.5(D) Q8.6(D) Q8.7(D) Q8.8(D) ; port VBUS
HI1: R96.2 R99.1 ; port HI1
HI2: R113.2 R115.1 ; port HI2
HI3: R119.2 R121.1 ; port HI3
IU: U39.5(OUT) ; port IU
IUVW: R125.1 U41.1(IN+) ; port IUVW
IW: U37.5(OUT) ; port IW
LO1: R98.2 R100.1 ; port LO1
LO2: R114.2 R116.1 ; port LO2
LO3: R120.2 R122.1 ; port LO3
OVERCURRENT: U41.4(OUT) ; port OVERCURRENT
SW1: C172.2 Q6.1(S) Q6.2(S) Q6.3(S) Q10.5(D) Q10.6(D) Q10.7(D) Q10.8(D) R95.1 R102.2 U31.4(HS)
SW2: C183.2 L7.1 Q7.1(S) Q7.2(S) Q7.3(S) Q11.5(D) Q11.6(D) Q11.7(D) Q11.8(D) R107.2 U35.4(HS)
SW3: C196.2 Q8.1(S) Q8.2(S) Q8.3(S) Q9.5(D) Q9.6(D) Q9.7(D) Q9.8(D) R97.1 R104.2 U38.4(HS)
U: C175.2 L6.2 ; port U
V: C176.2 L7.2 ; port V
VFBU: C184.2 D14.6(A) R106.1 R110.2 ; port VFBU
VFBV: C185.2 D14.5(A) R107.1 R111.2 ; port VFBV
VFBW: C186.2 D14.4(A) R108.1 R112.2 ; port VFBW
VHI1: D12.1(K) Q6.4(G) R94.2
VHI2: D19.1(K) Q7.4(G) R109.2
VHI3: D21.1(K) Q8.4(G) R118.2
VLO1: D13.1(K) Q10.4(G) R101.1
VLO2: D20.1(K) Q11.4(G) R117.1
VLO3: D22.1(K) Q9.4(G) R123.1
W: C177.2 L8.2 ; port W
NetC172_1: C172.1 U31.2(HB)
NetC173_2: C173.2 R96.1 U31.7(HI)
NetC174_2: C174.2 R98.1 U31.8(LI)
NetC178_1: C178.1 R102.1 U39.8(IN+)
NetC178_2: C178.2 R103.1 U39.1(IN-)
NetC179_1: C179.1 R104.1 U37.8(IN+)
NetC179_2: C179.2 R105.1 U37.1(IN-)
NetC183_1: C183.1 U35.2(HB)
NetC187_2: C187.2 R113.1 U35.7(HI)
NetC188_2: C188.2 R114.1 U35.8(LI)
NetC196_1: C196.1 U38.2(HB)
NetC199_2: C199.2 R119.1 U38.7(HI)
NetC200_2: C200.2 R120.1 U38.8(LI)
NetC267_1: C267.1 R127.1 U40.1(IN-)
NetC267_2: C267.2 R124.1 U40.8(IN+)
NetL6_1: L6.1 R95.2 R103.2 R106.2
NetL8_1: L8.1 R97.2 R105.2 R108.2
NetQ9_1: Q9.1(S) Q9.2(S) Q9.3(S) Q10.1(S) Q10.2(S) Q10.3(S) Q11.1(S) Q11.2(S) Q11.3(S) R124.2 R126.2
NetR94_1: R94.1 U31.3(HO)
NetR101_2: R101.2 U31.10(LO)
NetR109_1: R109.1 U35.3(HO)
NetR117_2: R117.2 U35.10(LO)
NetR118_1: R118.1 U38.3(HO)
NetR123_2: R123.2 U38.10(LO)
NetR125_2: R125.2 U40.5(OUT)

Not connected (* = marked no-connect by the designer): U31 5(NC)* 6(NC)*; U35 5(NC)* 6(NC)*; U38 5(NC)* 6(NC)*

### Channels
U_INVERTER-A: designators end in A; ports +1.5VREF=+1.5VREF +3.3V=+3.3V +3.3VA=+3.3VA +12V=+12V GND=GND HI1=HI1_U_INVERTER-A HI2=HI2_U_INVERTER-A HI3=HI3_U_INVERTER-A IU=IU_U_INVERTER-A IUVW=IUVW_U_INVERTER-A IW=IW_U_INVERTER-A LO1=LO1_U_INVERTER-A LO2=LO2_U_INVERTER-A LO3=LO3_U_INVERTER-A OVERCURRENT=OVERCURRENT_U_INVERTER-A U=UA V=VA VBUS=VBUS VFBU=VFBU_U_INVERTER-A VFBV=VFBV_U_INVERTER-A VFBW=VFBW_U_INVERTER-A W=WA
U_INVERTER-B: designators end in B; ports +1.5VREF=+1.5VREF +3.3V=+3.3V +3.3VA=+3.3VA +12V=+12V GND=GND HI1=HI1_U_INVERTER-B HI2=HI2_U_INVERTER-B HI3=HI3_U_INVERTER-B IU=IU_U_INVERTER-B IUVW=IUVW_U_INVERTER-B IW=IW_U_INVERTER-B LO1=LO1_U_INVERTER-B LO2=LO2_U_INVERTER-B LO3=LO3_U_INVERTER-B OVERCURRENT=OVERCURRENT_U_INVERTER-B U=UB V=VB VBUS=VBUS VFBU=VFBU_U_INVERTER-B VFBV=VFBV_U_INVERTER-B VFBW=VFBW_U_INVERTER-B W=WB

### Notes on the sheet
- 10..48 V
- Snubbing network using ceramic capacitors
- Gate Driver
- VBUS specifications
  Inom RMS = 10ARMS (14APK)
  Imax RMS = 30ARMS (40APK)
  ABSOLUTE MAXIMUM RATING
  I phase peak = 50 APK
- (near R95) Filter:
  Fc = 1 / (2 * pi * 2 * @{"Id":"WTLEFHSE\RGLIJYRB"} * @{"Id":"WTLEFHSE\LUPZFQRW"} )
- (near L6) LC Phase Filter:
  Imax: 5ADC, 20Apeak
  Vmax: 100V
  Fc = 1 / (2 * pi * sqrt( @{"Id":"WTLEFHSE\SJHXPBUV"} * @{"Id":"WTLEFHSE\EVTJYSFA"} ))
  Fc = 1 / (2 * pi * sqrt(1uH * 3.3nF)) = 2.7MHz
- (near R99) Pulldowns @{"Id":"WTLEFHSE\ORUCXNHD"}/ @{"Id":"WTLEFHSE\KBGLXWDE"} to make sure during DSP reset, none of the MOSFET would be ON.
- VFB = UPhase * Rbot / Rbot + Rtop)
- B-EMF Monitoring for Sensorless operations
- Current Measurement Gain:
  Vref=1.5 V
  Imax = 20 A
  Gain OPA = 20/20 V
  @{"Id":"WTLEFHSE\IHGGPBTC"} < Vref / G / Imax < 3.75 mΩ
- (near C197) DC CMRR 166-dB
  AC CMRR 105-dB @ 50 kHz
  -5V..110V
  0.02% gain error
  0.05ppm/°C
  Quiescent Current 2.5mA max
  BW 1.1 MHz -3dB
  SR 8 V/us
  49 nV/Hz^-2
- (near R126) VDiff
- ICom
- (near U40) Overcurrent Protection:
  Current Max = 30A @ @{"Id":"PVSFPOVX\QSRGIIQF"}
  Overcurrent Threshold = 15A
- Driver capabilities:
  Iout_max (source/sink): 4 A
  Rout: 0.9 Ohm
  VDD: 12V
  Fsw : 20..100 kHz
  MOSFET specifications:
  Rg: 1.7 Ohm (typ.), 3.4 Ohm (max)
  Qg: 18 nC
  Rdson_max: 15.5 Ohm @ VGS = 10V
  Design:
  Pg : Power dissipated per output by the driver
  dt : Delta time
  Iout : Driver output current (per output)
  dt_best = Qg / Iout_max  = 18nC / 4A = 4.5ns
  Pg = Qg * VDD * Fswitching = 18nC * 12V * 100kHz = 21.6mW
  Iout = VDD / (Rg + Rout + Rseries) = 12V / (1.7Ohm + 0.9Ohm + 5.6Ohm) = 1.46A
  dt = Qg / Iout = 18nC / 1.46A = 12.33ns
- HES-SO / HEIG-VD / TIN / IAI
  Route de Cheseaux, 1
  CH-1401 Yverdon-les-Bains
  T +41 24 557 73 77    F +41 24 557 63 20
  http://iai.heig-vd.ch
  iai@heig-vd.ch
- Title
- Size
- Date
- A4
- Project
- Sheet
- of
- No.
- Author
- SVN/Git
- Version
- File

### Library data of the parts
C159-C168 = CAP CER 100NF 100V C0G 1206: 100 nF ±5% 100V Ceramic Capacitor C0G, NP0 1206 (3216 Metric); Dielectric: NPO; Supplier 1: Digi-Key; Supplier Part Number 1: 445-172677-1-ND; Value: 100n
C169 C180 C191 = CAP CER 22UF 25V X5R 0805: 22 µF ±20% 25V Ceramic Capacitor X5R 0805 (2012 Metric); Dielectric: X5R; Supplier 1: Digi-Key; Supplier Part Number 1: 490-14661-1-ND
C170 C172 C181 C183 C189 C192 C194-C197 C258 C259 C261 C267-C270 C273 = CAP CER 100NF 25V X5R 0402: 100 nF ±10% 25V Ceramic Capacitor X5R 0402 (1005 Metric); Voltage: 25V; Dielectric: X5R; Supplier 1: Digi-Key; Supplier Part Number 1: 1276-1043-1-ND; Value: 100n
C171 C182 C190 C193 C198 C262 = CAP CER 10NF 50V X7R 0402: 10 nF ±10% 50V Ceramic Capacitor X7R 0402 (1005 Metric); Voltage: 50V; Dielectric: X7R; Supplier 1: Digi-Key; Supplier Part Number 1: 1276-1028-1-ND; Value: 10n
C173 C174 C187 C188 C199 C200 = CAP CER 220PF 50V C0G/NP0 0402: 220 pF ±5% 50V Ceramic Capacitor C0G, NP0 0402 (1005 Metric); Dielectric: NPO; Voltage: 50V; Supplier 1: Digi-Key; Supplier Part Number 1: 1276-1059-1-ND; Value: 220p
C175-C179 = CAP CER 3.3NF 100V X8R 0402: 3.3 nF ±10% 100V Ceramic Capacitor X8R 0402 (1005 Metric); Voltage: 16V; Dielectric: X7R; Supplier 1: Digi-Key; Supplier Part Number 1: 445-15951-1-ND; Value: 3.3n
C184-C186 = CAP CER 22PF 50V C0G/NPO 0402: 22 pF ±2% 50V Ceramic Capacitor C0G, NP0 0402 (1005 Metric); Dielectric: NPO; Voltage: 50V; Supplier 1: Digi-Key; Supplier Part Number 1: 311-1652-1-ND; Value: 22p
D12 D13 D19-D22 = DIODE ZENER 15V 300MW SOD323: Zener Diode 15 V 300 mW ±5% Surface Mount SOD-323; Mounting: SMD; Supplier 1: Digi-Key; Supplier Part Number 1: 1727-4986-1-ND
D14 = SD103ATW-7-F: DIODE ARRAY SCHOTTKY 40V SOT363 / Diode Array 3 Independent Schottky 40 V 175mA Surface Mount 6-TSSOP, SC-88, SOT-363; Supplier 1: Digi-Key; Supplier Part Number 1: SD103ATW-FDICT-ND
L6-L8 = PA5005.102NLT: 1 µH Shielded Molded Inductor 20 A 4.52mOhm Max Nonstandard; Isat: 23A; Value: 1u; Supplier 1: Digi-Key; Supplier Part Number 1: 553-4098-1-ND
Q6-Q11 = RQ3P300BHTB1: N-Channel 100 V 39A (Ta) 2W (Ta) Surface Mount 8-HSMT (3.2x3); Supplier 1: Digi-Key; Supplier Part Number 1: 846-RQ3P300BHTB1CT-ND
R94 R101 R109 R117 R118 R123 = RES 5.6 OHM 5% 1/16W 0402: 5.6 Ohms ±5% 0.063W, 1/16W Chip Resistor 0402 (1005 Metric) Moisture Resistant Thick Film; Supplier 1: Digi-Key; Supplier Part Number 1: 311-5.6JRCT-ND; Value: 5.6
R95 R97 R126 = RES 0.002 OHM 1% 1W 1206: 2 mOhms ±1% 1W Chip Resistor 1206 (3216 Metric) Current Sense, Moisture Resistant Metal Element; Supplier 1: Digi-Key; Supplier Part Number 1: CSNL1206FT2L00CT-ND; Value: 2m
R96 R98 R113 R114 R119 R120 = RES 120 OHM 1% 1/16W 0402: 120 Ohms ±1% 0.063W, 1/16W Chip Resistor 0402 (1005 Metric) Moisture Resistant Thick Film; Supplier 1: Digi-Key; Supplier Part Number 1: 311-120LRCT-ND; Value: 120
R99 R100 R110-R112 R115 R116 R121 R122 = RES 10K OHM 1% 1/16W 0402: 10 kOhms ±1% 0.063W, 1/16W Chip Resistor 0402 (1005 Metric) Moisture Resistant Thick Film; Supplier 1: Digi-Key; Supplier Part Number 1: 1276-3431-1-ND; Value: 10k
R102-R105 R124 R127 = RES 100 OHM 1% 1/16W 0402: 100 Ohms ±1% 0.063W, 1/16W Chip Resistor 0402 (1005 Metric) Moisture Resistant Thick Film; Supplier 1: Digi-Key; Supplier Part Number 1: 13-RC0402FR-13100RLCT-ND; Value: 100
R106-R108 R129 = RES 300K OHM 1% 1/16W 0402: 300 kOhms ±1% 0.063W, 1/16W Chip Resistor 0402 (1005 Metric) Moisture Resistant Thick Film; Value: 300k; Supplier 1: Digi-Key; Supplier Part Number 1: 311-300KLRCT-ND
R125 = RES 22 OHM 1% 1/16W 0402: 22 Ohms ±1% 0.063W, 1/16W Chip Resistor 0402 (1005 Metric) Moisture Resistant Thick Film; Value: 22; Supplier 1: Digi-Key; Supplier Part Number 1: 311-22.0LRCT-ND
R128 = RES 162K OHM 1% 1/16W 0402: 162 kOhms ±1% 0.063W, 1/16W Chip Resistor 0402 (1005 Metric) Moisture Resistant Thick Film; Supplier 1: Digi-Key; Supplier Part Number 1: YAG2370CT-ND; Value: 162k
U31 U35 U38 = UCC27212: Half-Bridge Gate Driver IC Non-Inverting 10-WSON (4x4); Supplier 1: Digi-Key; Supplier Part Number 1: 296-47091-1-ND
U37 U39 = INA241A2IDDFR: Current Sense Amplifier 1 Circuit Single-Ended TSOT-23-8; Supplier 1: Digi-Key; Supplier Part Number 1: 296-INA241A2IDDFRDKR-ND
U40 = INA241A1IDDFR: Current Sense Amplifier 10V/V  1 Circuit Single-Ended TSOT-23-8; Supplier 1: Digi-Key; Supplier Part Number 1: 296-INA241A1IDDFRCT-ND
U41 = LM331: Comparator General Purpose CMOS, Open-Collector, TTL SOT-23-5; Supplier 1: Digi-Key; Supplier Part Number 1: 296-6633-1-ND

## Sheet digital-encoder.SchDoc: Absolute Serial Encoder + Incremental
size A3; SheetNumber: 8; SheetTotal: 18
Used 2 times, as channels U_ENC-A, U_ENC-A. Parts and nets are listed once, with the designators drawn on the sheet.
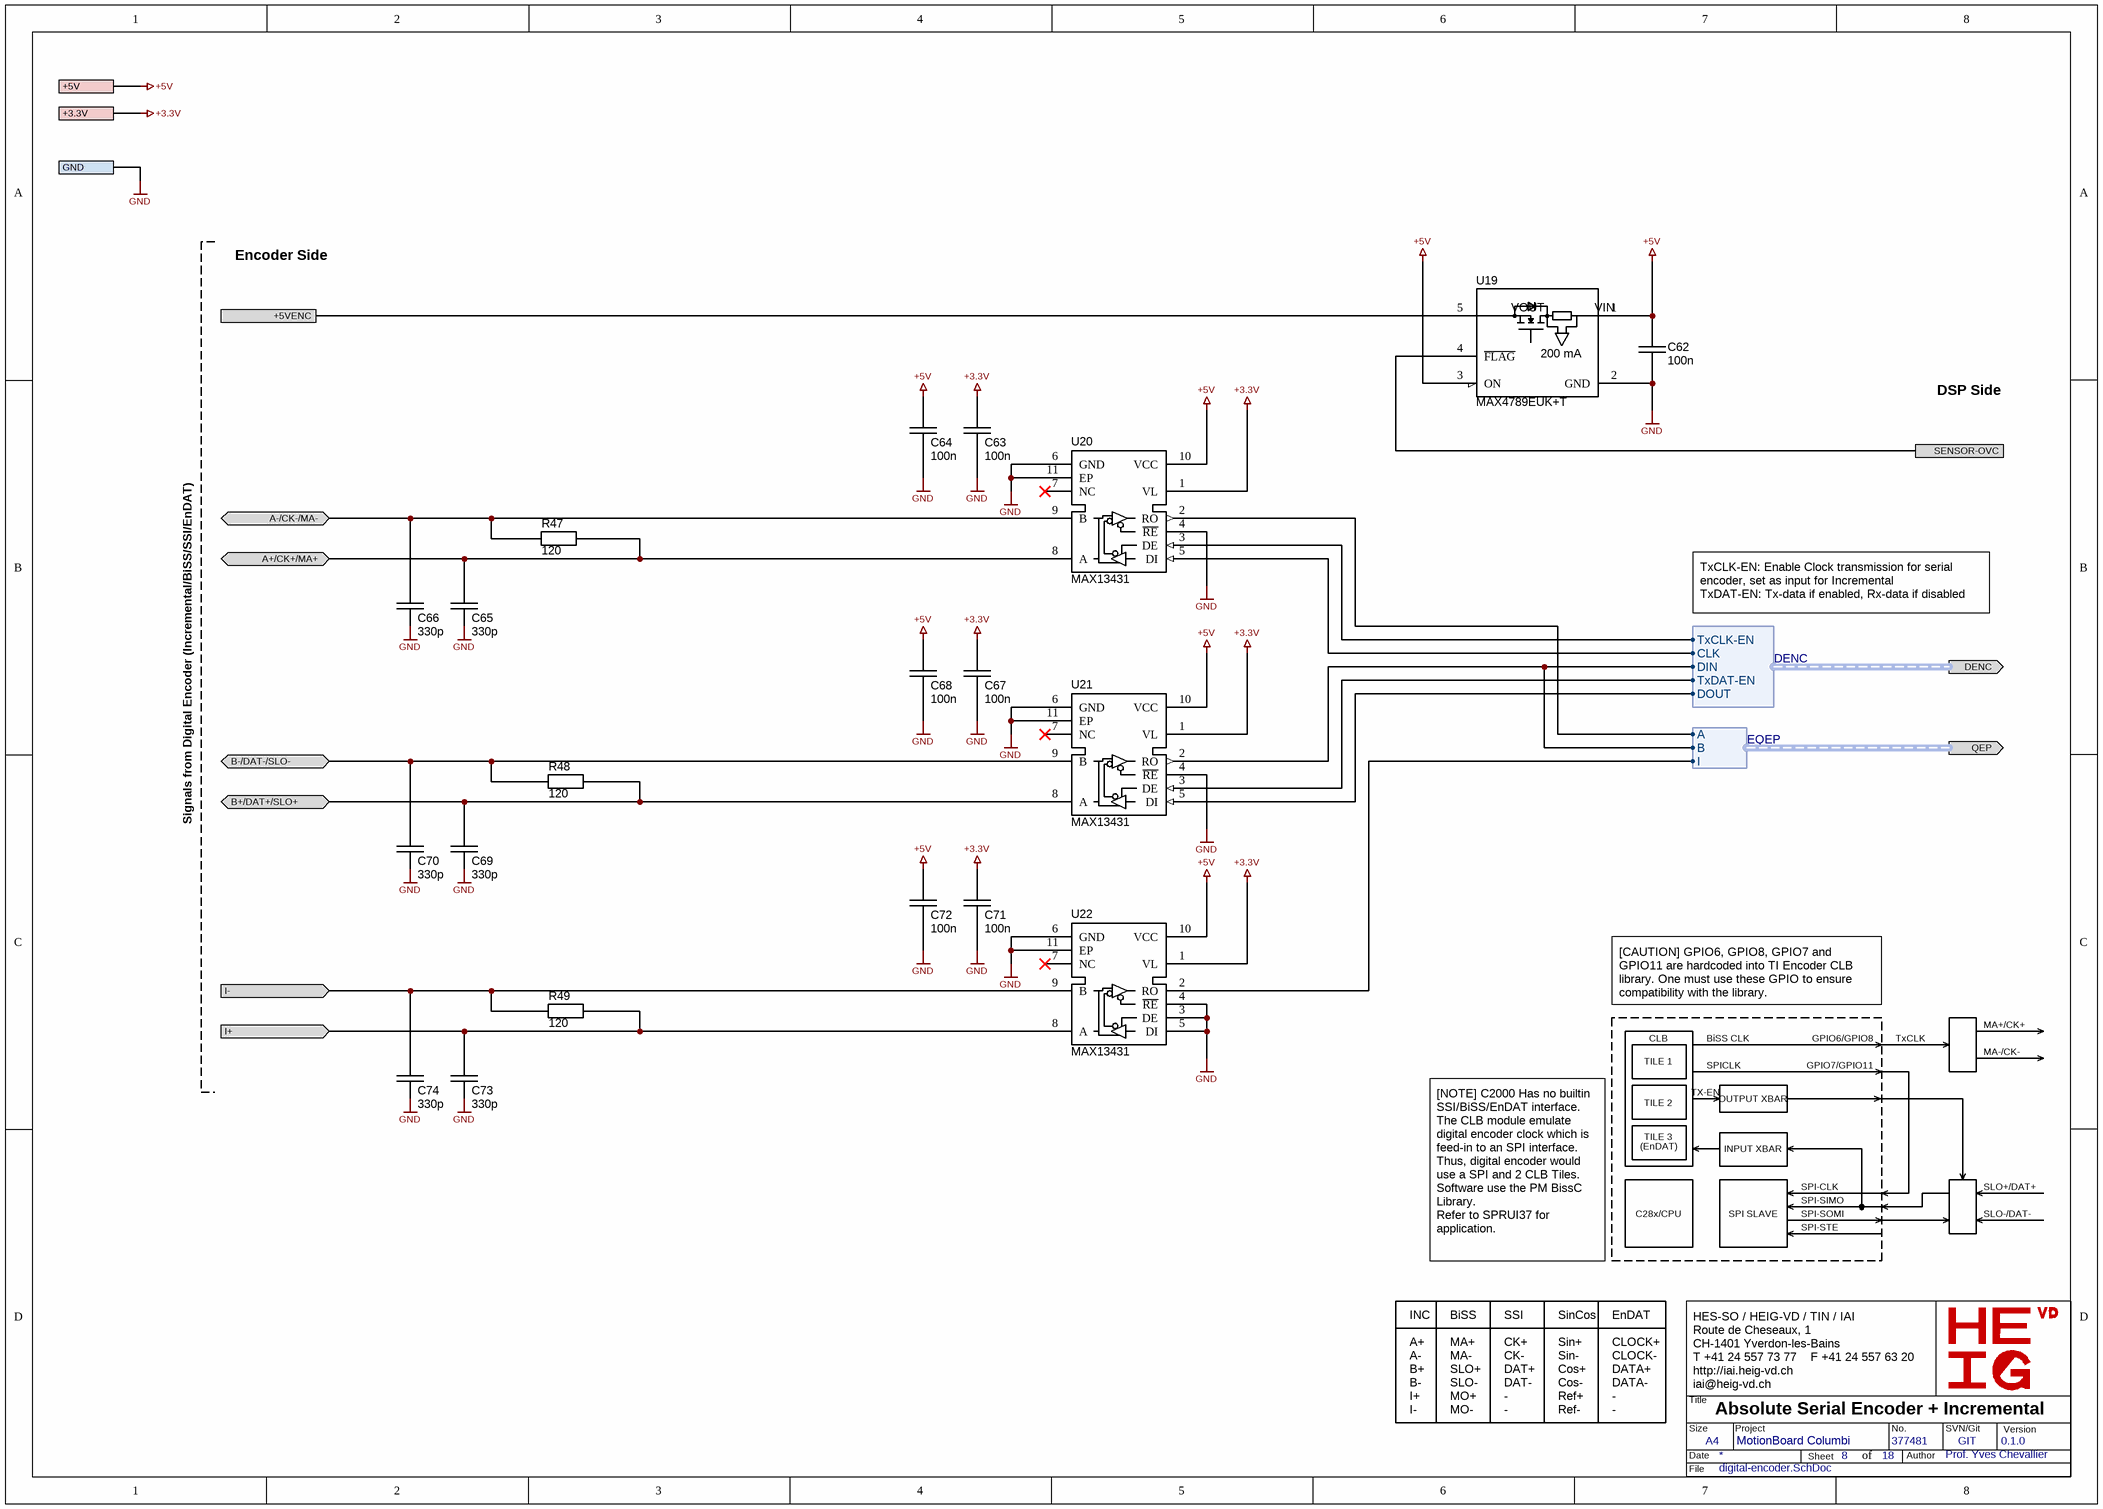
[diagram p3: digital-encoder.SchDoc]

### Parts
C62  100n  [SM/C0402]
C63  100n  [SM/C0402]
C64  100n  [SM/C0402]
C65  330p  [SM/C0402]
C66  330p  [SM/C0402]
C67  100n  [SM/C0402]
C68  100n  [SM/C0402]
C69  330p  [SM/C0402]
C70  330p  [SM/C0402]
C71  100n  [SM/C0402]
C72  100n  [SM/C0402]
C73  330p  [SM/C0402]
C74  330p  [SM/C0402]
R47  120  [SM/R0402]
R48  120  [SM/R0402]
R49  120  [SM/R0402]
U19  MAX4789EUK+T  [SOT23-5]
U20  MAX13431  [DFN10_3x3MC_MCH-M]
U21  MAX13431  [DFN10_3x3MC_MCH-M]
U22  MAX13431  [DFN10_3x3MC_MCH-M]

### Ports
+3.3V, +5V, +5VENC, A+/CK+/MA+ (bidir), A-/CK-/MA- (bidir), B+/DAT+/SLO+ (bidir), B-/DAT-/SLO- (bidir), DENC (out, harness DENC), GND, I+ (in), I- (in), QEP (out, harness EQEP), SENSOR-OVC

### Harnesses
EQEP: A, B, I
DENC: CLK, DIN, DOUT, TxCLK-EN, TxDAT-EN

### Nets
+3.3V: C63.2 C67.2 C71.2 U20.1(VL) U21.1(VL) U22.1(VL) ; port +3.3V
+5V: C62.1 C64.2 C68.2 C72.2 U19.1(VIN) U19.3(ON) U20.10(VCC) U21.10(VCC) U22.10(VCC) ; port +5V
GND: C62.2 C63.1 C64.1 C65.2 C66.2 C67.1 C68.1 C69.2 C70.2 C71.1 C72.1 C73.2 C74.2 U19.2(GND) U20.4(~{RE}) U20.6(GND) U20.11(EP) U21.4(~{RE}) U21.6(GND) U21.11(EP) U22.3(DE) U22.4(~{RE}) U22.5(DI) U22.6(GND) U22.11(EP) ; port GND
+5VENC: U19.5(VOUT) ; port +5VENC
A+/CK+/MA+: C65.1 R47.1 U20.8(A) ; port A+/CK+/MA+
A-/CK-/MA-: C66.1 R47.2 U20.9(B) ; port A-/CK-/MA-
B+/DAT+/SLO+: C69.1 R48.1 U21.8(A) ; port B+/DAT+/SLO+
B-/DAT-/SLO-: C70.1 R48.2 U21.9(B) ; port B-/DAT-/SLO-
I+: C73.1 R49.1 U22.8(A) ; port I+
I-: C74.1 R49.2 U22.9(B) ; port I-
SENSOR-OVC: U19.4(~{FLAG}) ; port SENSOR-OVC
NetU20_2: U20.2(RO) ; port QEP.A
NetU20_3: U20.3(DE) ; port DENC.TxCLK-EN
NetU20_5: U20.5(DI) ; port DENC.CLK
NetU21_2: U21.2(RO) ; port QEP.B, port DENC.DIN
NetU21_3: U21.3(DE) ; port DENC.TxDAT-EN
NetU21_5: U21.5(DI) ; port DENC.DOUT
NetU22_2: U22.2(RO) ; port QEP.I

Not connected (* = marked no-connect by the designer): U20 7(NC)*; U21 7(NC)*; U22 7(NC)*

### Channels
U_ENC-A: designators end in A; ports +3.3V=+3.3V +5V=+5V +5VENC=+5VENCA A+/CK+/MA+=ENCA-A+ A-/CK-/MA-=ENCA-A- B+/DAT+/SLO+=ENCA-B+ B-/DAT-/SLO-=ENCA-B- GND=GND I+=ENCA-C+ I-=ENCA-C- SENSOR-OVC=SENSOR-OVC_U_ENC-A
U_ENC-A: designators end in B; ports +3.3V=+3.3V +5V=+5V +5VENC=+5VENCB A+/CK+/MA+=ENCB-A+ A-/CK-/MA-=ENCB-A- B+/DAT+/SLO+=ENCB-B+ B-/DAT-/SLO-=ENCB-B- GND=GND I+=ENCB-C+ I-=ENCB-C- SENSOR-OVC=SENSOR-OVC_U_ENC-A

### Notes on the sheet
- Encoder Side
- DSP Side
- Signals from Digital Encoder (Incremental/BiSS/SSI/EnDAT)
- TxCLK-EN: Enable Clock transmission for serial encoder, set as input for Incremental
  TxDAT-EN: Tx-data if enabled, Rx-data if disabled
- [CAUTION] GPIO6, GPIO8, GPIO7 and GPIO11 are hardcoded into TI Encoder CLB library. One must use these GPIO to ensure compatibility with the library.
- CLB
- TILE 1
- BiSS CLK
- GPIO6/GPIO8
- TxCLK
- MA+/CK+
- MA-/CK-
- TILE 2
- SPICLK
- TX-EN
- OUTPUT XBAR
- GPIO7/GPIO11
- TILE 3
- (EnDAT)
- INPUT XBAR
- SPI-CLK
- SLO+/DAT+
- [NOTE] C2000 Has no builtin SSI/BiSS/EnDAT interface. The CLB module emulate digital encoder clock which is feed-in to an SPI interface. Thus, digital encoder would use a SPI and 2 CLB Tiles.
  Software use the PM BissC Library.
  Refer to SPRUI37 for application.
- C28x/CPU
- SPI SLAVE
- SPI-SIMO
- SPI-SOMI
- SPI-STE
- SLO-/DAT-
- INC
- BiSS
- SSI
- SinCos
- EnDAT
- A+
- A-
- B+
- B-
- I+
- MA+
- MA-
- SLO+
- SLO-
- MO+
- CK+
- CK-
- DAT+
- DAT-
- -
- Sin+
- Sin-
- Cos+
- Cos-
- Ref+
- CLOCK+
- CLOCK-
- DATA+
- DATA-
- I-
- MO-
- Ref-
- HES-SO / HEIG-VD / TIN / IAI
  Route de Cheseaux, 1
  CH-1401 Yverdon-les-Bains
  T +41 24 557 73 77    F +41 24 557 63 20
  http://iai.heig-vd.ch
  iai@heig-vd.ch
- Title
- Size
- Date
- A4
- Project
- Sheet
- of
- No.
- Author
- SVN/Git
- Version
- File
- (in symbol MAX4789) 200 mA

### Library data of the parts
C62-C64 C67 C68 C71 C72 = CAP CER 100NF 25V X5R 0402: as C170 on sheet inverter; Voltage: 25V; Dielectric: X5R; Supplier 1: Digi-Key; Supplier Part Number 1: 1276-1043-1-ND; Value: 100n
C65 C66 C69 C70 C73 C74 = CAP CER 330PF 50V C0G/NP0 0402: 330 pF ±5% 50V Ceramic Capacitor C0G, NP0 0402 (1005 Metric); Dielectric: NPO; Voltage: 50V; Supplier 1: Digi-Key; Supplier Part Number 1: 490-4928-1-ND; Value: 330p
R47-R49 = RES 120 OHM 1% 1/16W 0402: as R96 on sheet inverter; Supplier 1: Digi-Key; Supplier Part Number 1: 311-120LRCT-ND; Value: 120
U19 = MAX4789: Current Limiting Regulator 200mA SOT-23-5; Voltage: 2.3..5.5V; Supplier 1: Digi-Key; Supplier Part Number 1: MAX4789EUK+TCT-ND
U20-U22 = MAX13431: 1/1 Transceiver Half RS422, RS485 10-TDFN (3x3); Supplier 1: Digi-Key; Supplier Part Number 1: MAX13431EETB+TCT-ND

## Sheet can.SchDoc: CAN/CANOpen Interface
size A4; SheetNumber: 13; SheetTotal: 17
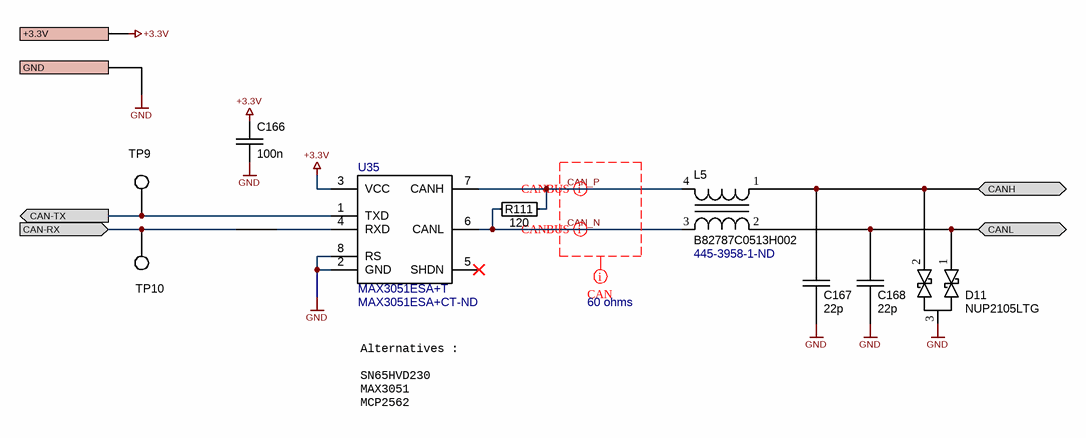
[diagram p4: can.SchDoc]

### Parts
C166  value 100n  [SM/C0402]  (hidden comment: CL05A104KP5NNNC)
C167  22p  [SM/C0402]
C168  22p  [SM/C0402]
D11  NUP2105LTG  [SOT23-3]
L5  B82787C0513H002  Supplier Part Number 1: 445-3958-1-ND  [ACT45B]
R111  120  [SM/R0402]
TP9  RCUCTE  [TP/RCUCT]  (value not drawn)
TP10  RCUCTE  [TP/RCUCT]  (value not drawn)
U35  MAX3051ESA+T  Supplier Part Number 1: MAX3051ESA+CT-ND  [SOIC8]

### Ports
+3.3V, CAN-RX (in), CAN-TX (out), CANH (bidir), CANL (bidir), GND

### Nets
+3.3V: C166.1 U35.3(VCC) ; port +3.3V
GND: C166.2 C167.2 C168.2 D11.3 U35.2(GND) U35.8(RS) ; port GND
CAN-RX: TP10.1 U35.4(RXD) ; port CAN-RX
CAN-TX: TP9.1 U35.1(TXD) ; port CAN-TX
CAN_N: L5.3 R111.1 U35.6(CANL)
CAN_P: L5.4 R111.2 U35.7(CANH)
CANH: C167.1 D11.2 L5.1 ; port CANH
CANL: C168.1 D11.1 L5.2 ; port CANL

Not connected (* = marked no-connect by the designer): U35 5(SHDN)*

### Layout directives
differential pair: CAN_N, CAN_P
rule Impedance Constraint [Min = 50.00    Max = 70.00    ]; Impedance: 60 ohms: CAN_N, CAN_P

### Notes on the sheet
- Alternatives :
  SN65HVD230
  MAX3051
  MCP2562
- HES-SO / HEIG-VD / TIN / IAI
  Route de Cheseaux, 1
  CH-1401 Yverdon-les-Bains
  +41 24 557 73 77
  http://iai.heig-vd.ch
  iai@heig-vd.ch
- Title
- Format
- Date
- A4
- Project Name
- Author
- Project ID
- VCS
- Revision
- Page
- /
- File

### Library data of the parts
C166 = C: Chip Capacitor; Voltage: 16V; Dielectric: X7R; Supplier 1: Digi-Key; Supplier Part Number 1: 1276-1022-1-ND
C167 C168 = C: 22 pF ±2% 50V Ceramic Capacitor C0G, NP0 0402 (1005 Metric); Dielectric: NPO; Supplier 1: Digi-Key; Supplier Part Number 1: 311-1652-1-ND; Value: 22p; Voltage: 50V
L5 = L_B82787C0513H002: CMC 51UH 200MA 2LN SMD AEC-Q200; Supplier 1: Digi-Key
R111 = R: Chip Resistor SMD; Supplier 1: Digi-Key; Supplier Part Number 1: 311-120LRCT-ND; Value: 120
TP9 TP10 = TP: as TP1 on sheet main; Supplier 1: Digi-Key; Supplier Part Number 1: 2019-RCUCTECT-ND
U35 = MAX3051: 1/1 Transceiver Half CANbus 8-SOIC; Supplier 1: Digi-Key
D11 = NUP2105LTG: Supplier 1: Digi-Key; Supplier Part Number 1: NUP2105LT1GOSCT-ND